# Altium schematic sheet VESC_KS75600_power_connector.SchDoc
size A3; SheetNumber: 3; SheetTotal: 6
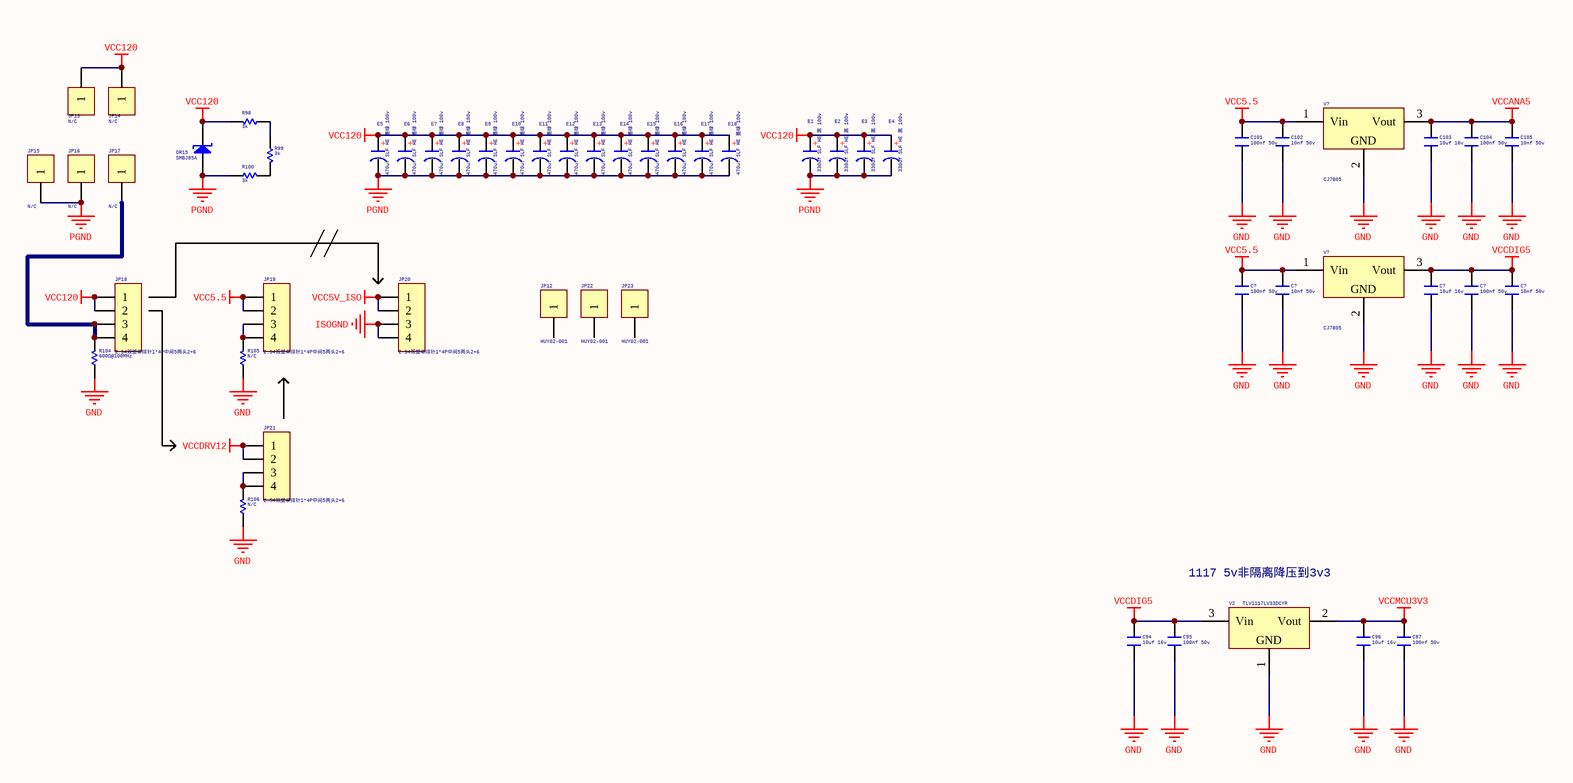
[diagram p0: VESC_KS75600_power_connector.SchDoc]

## Parts
(Parts that share a designator on the sheet are numbered #1, #2 ... from top to bottom, then left to right.)
C94  10uf 16v  [C 0805]
C95  100nf 50v  [C 0603]
C96  10uf 16v  [C 0805]
C97  100nf 50v  [C 0603]
C101  100nf 50v  [C 0603]
C102  10nf 50v  [C 0603]
C103  10uf 16v  [C 0805]
C104  100nf 50v  [C 0603]
C105  10nf 50v  [C 0603]
C?#1  100nf 50v  [C 0603]
C?#2  10nf 50v  [C 0603]
C?#3  100nf 50v  [C 0603]
C?#4  10nf 50v  [C 0603]
C?#5  10uf 16v  [C 0805]
DR15  SMBJ85A  [SMB]
E1  330uf SLF HE 黑 100v  [CAP 5.0*13.5*26]
E2  330uf SLF HE 黑 100v  [CAP 5.0*13.5*26]
E3  330uf SLF HE 黑 100v  [CAP 5.0*13.5*26]
E4  330uf SLF HE 黑 100v  [CAP 5.0*13.5*26]
E5  470uf SLF HE 墨绿 100v  [CAP 7.5*16.5*27]
E6  470uf SLF HE 墨绿 100v  [CAP 7.5*16.5*27]
E7  470uf SLF HE 墨绿 100v  [CAP 7.5*16.5*27]
E8  470uf SLF HE 墨绿 100v  [CAP 7.5*16.5*27]
E9  470uf SLF HE 墨绿 100v  [CAP 7.5*16.5*27]
E10  470uf SLF HE 墨绿 100v  [CAP 7.5*16.5*27]
E11  470uf SLF HE 墨绿 100v  [CAP 7.5*16.5*27]
E12  470uf SLF HE 墨绿 100v  [CAP 7.5*16.5*27]
E13  470uf SLF HE 墨绿 100v  [CAP 7.5*16.5*27]
E14  470uf SLF HE 墨绿 100v  [CAP 7.5*16.5*27]
E15  470uf SLF HE 墨绿 100v  [CAP 7.5*16.5*27]
E16  470uf SLF HE 墨绿 100v  [CAP 7.5*16.5*27]
E17  470uf SLF HE 墨绿 100v  [CAP 7.5*16.5*27]
E18  470uf SLF HE 墨绿 100v  [CAP 7.5*16.5*27]
JP12  HUY02-001  [HUY02-001]
JP13  N/C  [12x7上下层铜环]
JP14  N/C  [12x7上下层铜环]
JP15  N/C  [12x7上下层铜环]
JP16  N/C  [12x7上下层铜环]
JP17  N/C  [12x7上下层铜环]
JP18  2.54双塑单排针1*4P中间5两头2+6  [HDR-1X4]
JP19  2.54双塑单排针1*4P中间5两头2+6  [HDR-1X4]
JP20  2.54双塑单排针1*4P中间5两头2+6  [HDR-1X4]
JP21  2.54双塑单排针1*4P中间5两头2+6  [HDR-1X4]
JP22  HUY02-001  [HUY02-001]
JP23  HUY02-001  [HUY02-001]
R98  3k  [R 2512]
R99  3k  [R 2512]
R100  3k  [R 2512]
R104  600Ω@100MHz  [R 0805]
R105  N/C  [R 0805]
R106  N/C  [R 0805]
V2  TLV1117LV33DCYR  [SOT223_L]
V?#1  CJ7805  [TO252]
V?#2  CJ7805  [TO252]

## Nets
GND: C94.2 C95.2 C96.2 C97.2 C101.2 C102.2 C103.1 C104.2 C105.2 C?#1.2 C?#2.2 C?#3.2 C?#4.2 C?#5.1 R104.1 R105.1 R106.1 V2.1(GND) V?#1.2(GND) V?#2.2(GND)
ISOGND: JP20.3 JP20.4
PGND: DR15.1(A) E1.2 E2.2 E3.2 E4.2 E5.2 E6.2 E7.2 E8.2 E9.2 E10.2 E11.2 E12.2 E13.2 E14.2 E15.2 E16.2 E17.2 E18.2 JP15.1 JP16.1 R100.1
VCC5.5: C101.1 C102.1 C?#1.1 C?#2.1 JP19.1 JP19.2 V?#1.1(Vin) V?#2.1(Vin)
VCC5V_ISO: JP20.1 JP20.2
VCC120: DR15.2(K) E1.1 E2.1 E3.1 E4.1 E5.1 E6.1 E7.1 E8.1 E9.1 E10.1 E11.1 E12.1 E13.1 E14.1 E15.1 E16.1 E17.1 E18.1 JP13.1 JP14.1 JP18.1 JP18.2 R98.2
VCCANA5: C103.2 C104.1 C105.1 V?#1.3(Vout)
VCCDIG5: C94.1 C95.1 C?#3.1 C?#4.1 C?#5.2 V2.3(Vin) V?#2.3(Vout)
VCCDRV12: JP21.1 JP21.2
VCCMCU3V3: C96.1 C97.1 V2.2(Vout)
NetJP17_1: JP17.1 JP18.3 JP18.4 R104.2
NetJP19_3: JP19.3 JP19.4 R105.2
NetJP21_3: JP21.3 JP21.4 R106.2
NetR98_1: R98.1 R99.1
NetR99_2: R99.2 R100.2

Not connected (* = marked no-connect by the designer): JP12 1; JP22 1; JP23 1

## Notes on the sheet
- 1117 5v非隔离降压到3v3
- (in symbol C-CAP) +

## Library data of the parts
C94-C97 C101-C105 C?#1-C?#5 = C: 无极性贴片电容
  C94 C96 C103 C?#5: Voltage: 16v; Value: 10uf
  C95 C97 C101 C104 C?#1 C?#3: Voltage: 50v; Value: 100nf
  C102 C105 C?#2 C?#4: Voltage: 50v; Value: 10nf
DR15 = DR_S: 瞬态电压抑制二极管(单向)
E1-E18 = C-CAP: 直插电解电容; Voltage: 100v
  E1-E4: Value: 330uf SLF HE 黑
  E5-E18: Value: 470uf SLF HE 墨绿
JP12-JP17 JP22 JP23 = Header 1: 1P接插件
JP18-JP21 = Header 4: 4P接插件
R98-R100 R104-R106 = R: 贴片电阻
  R98-R100: Value: 3k
  R104: Value: 600Ω@100MHz
  R105 R106: Value: N/C
V2 = AMS1117: 三端稳压芯片
V?#1 V?#2 = 78xx: 线性稳压芯片